# EAGLE design openSIM_interconenctBoard (EAGLE 9.5.2)
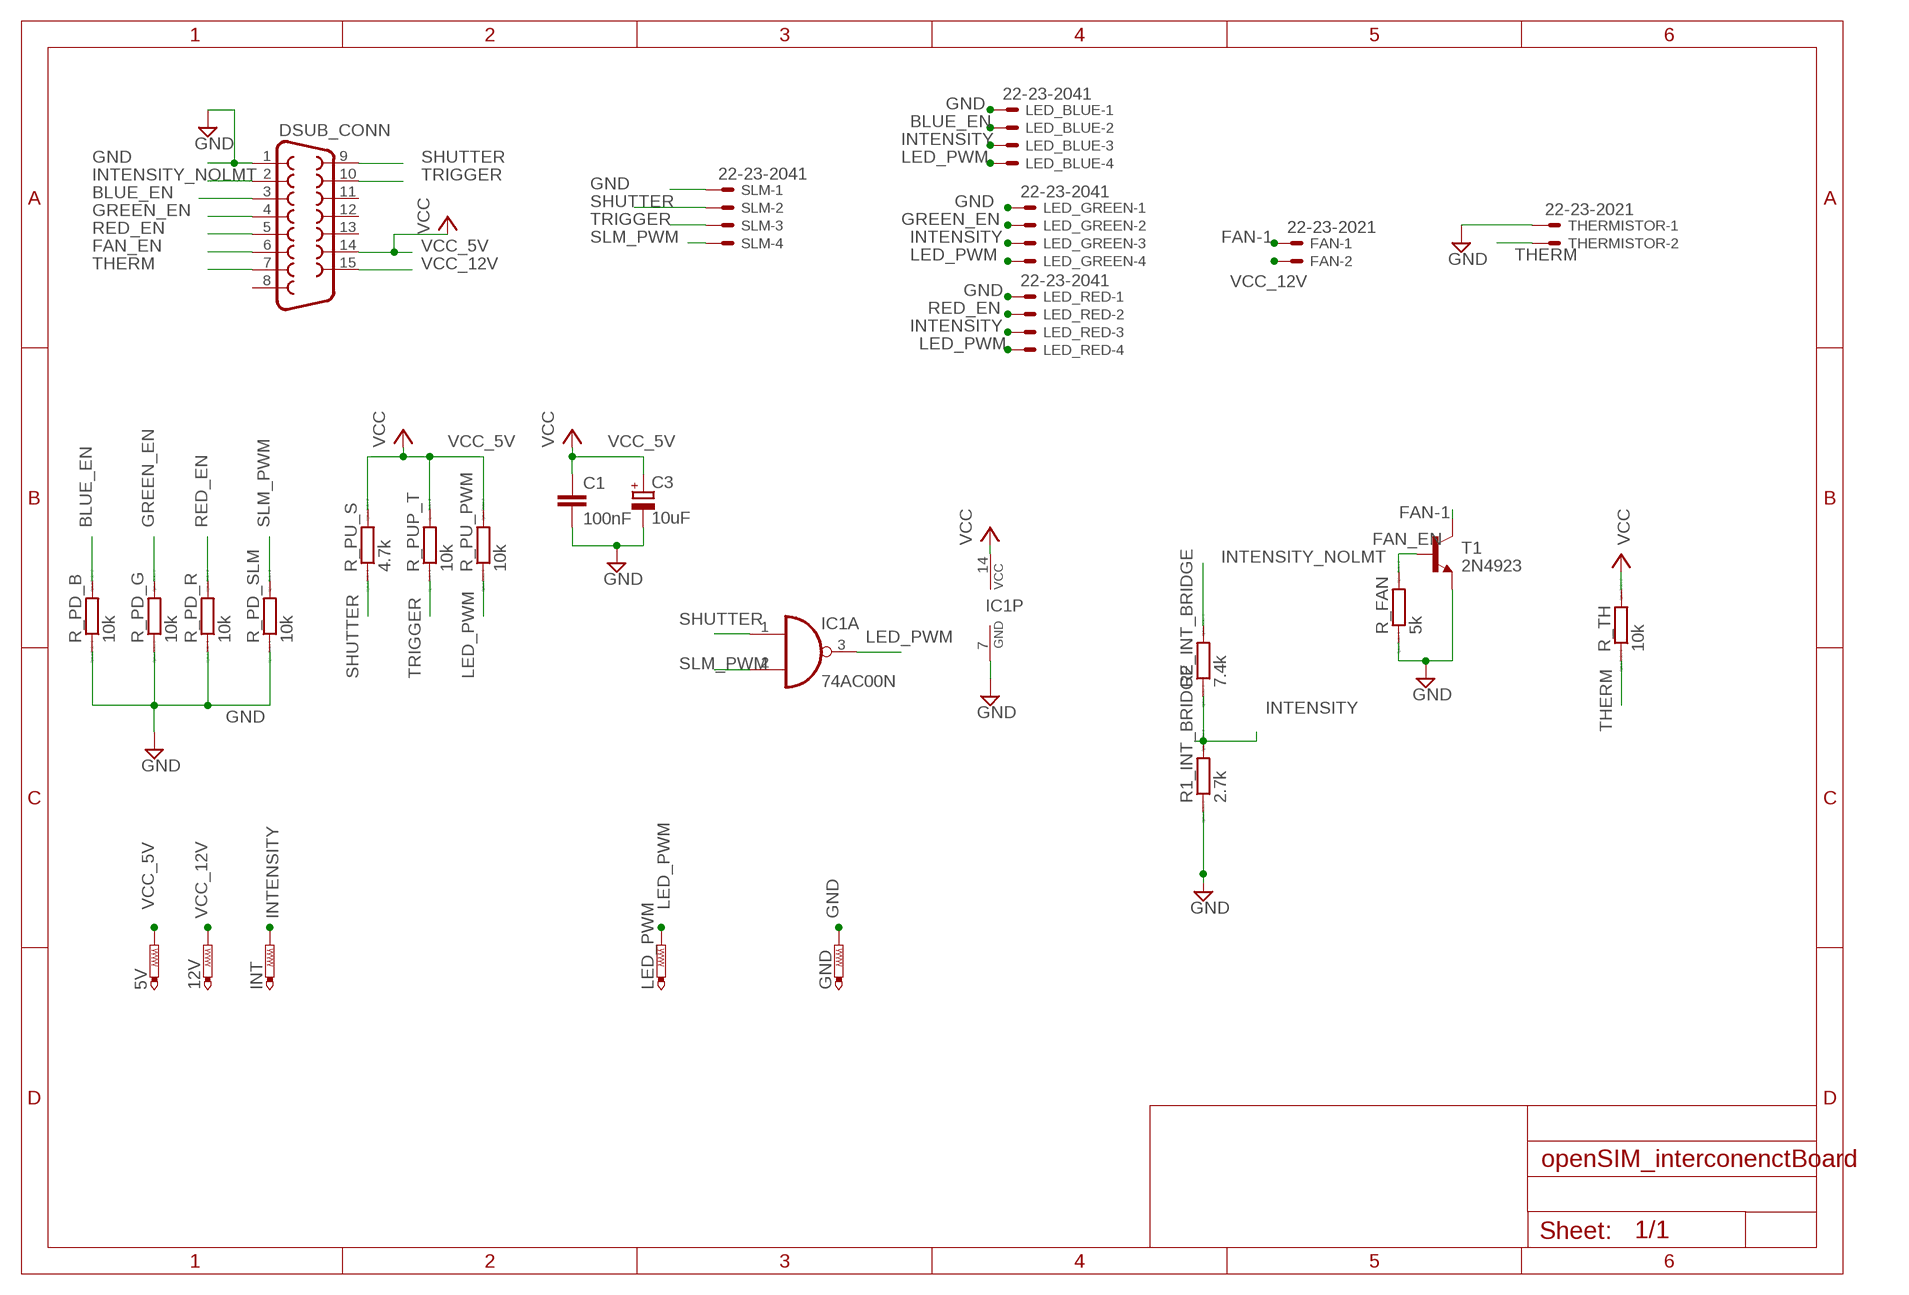
[diagram p0: schematic, sheet 1]

## Parts
5V  PTR1PAD1-20  [P1-20]
12V  PTR1PAD1-20  [P1-20]
C1  100nF  C-EU050-025X075  [C050-025X075]
C3  10uF  CPOL-EUE2,5-6E  [E2,5-6E]
DSUB_CONN  F15V  [F15V]
FAN  22-23-2021  [22-23-2021]
GND  PTR1PAD1-13Y  [P1-13Y]
IC1  74AC00N  [DIL14]
INT  PTR1PAD1-20  [P1-20]
LED_BLUE  22-23-2041  [22-23-2041]
LED_GREEN  22-23-2041  [22-23-2041]
LED_PWM  PTR1PAD1-20  [P1-20]
LED_RED  22-23-2041  [22-23-2041]
R1_INT_BRIDGE  2.7k  R0207/10  [0207/10]
R2_INT_BRIDGE  7.4k  R0207/10  [0207/10]
R_FAN  5k  R0207/10  [0207/10]
R_PD_B  10k  R0207/10  [0207/10]
R_PD_G  10k  R0207/10  [0207/10]
R_PD_R  10k  R0207/10  [0207/10]
R_PD_SLM  10k  R0207/10  [0207/10]
R_PU_PWM  10k  R0207/10  [0207/10]
R_PU_S  4.7k  R0207/10  [0207/10]
R_PUP_T  10k  R0207/10  [0207/10]
R_TH  10k  R0207/10  [0207/10]
SLM  22-23-2041  [22-23-2041]
T1  2N4923  [TO126]
THERMISTOR  22-23-2021  [22-23-2021]

## Nets
BLUE_EN: DSUB_CONN.3 LED_BLUE.2 R_PD_B.2
FAN-1: FAN.1 T1.2(C)
FAN_EN: DSUB_CONN.6 R_FAN.2 T1.3(B)
GND: C1.2 C3.- DSUB_CONN.1 GND.TP IC1.7(P:GND) LED_BLUE.1 LED_GREEN.1 LED_RED.1 R1_INT_BRIDGE.1 R_FAN.1 R_PD_B.1 R_PD_G.1 R_PD_R.1 R_PD_SLM.1 SLM.1 T1.1(E) THERMISTOR.1
GREEN_EN: DSUB_CONN.4 LED_GREEN.2 R_PD_G.2
INTENSITY: INT.TP LED_BLUE.3 LED_GREEN.3 LED_RED.3 R1_INT_BRIDGE.2 R2_INT_BRIDGE.1
INTENSITY_NOLMT: DSUB_CONN.2 R2_INT_BRIDGE.2
LED_PWM: IC1.3(A:O) LED_BLUE.4 LED_GREEN.4 LED_PWM.TP LED_RED.4 R_PU_PWM.1
RED_EN: DSUB_CONN.5 LED_RED.2 R_PD_R.2
SHUTTER: DSUB_CONN.9 IC1.1(A:I0) R_PU_S.1 SLM.2
SLM_PWM: IC1.2(A:I1) R_PD_SLM.2 SLM.4
THERM: DSUB_CONN.7 R_TH.1 THERMISTOR.2
TRIGGER: DSUB_CONN.10 R_PUP_T.1 SLM.3
VCC_5V: 5V.TP C1.1 C3.+ DSUB_CONN.14 IC1.14(P:VCC) R_PU_PWM.2 R_PU_S.2 R_PUP_T.2 R_TH.2 ; supply symbol labelled VCC
VCC_12V: 12V.TP DSUB_CONN.15 FAN.2
Unconnected: DSUB_CONN.8 DSUB_CONN.11 DSUB_CONN.12 DSUB_CONN.13 IC1.4(B:I0) IC1.5(B:I1) IC1.6(B:O) IC1.8(C:O) IC1.9(C:I0) IC1.10(C:I1) IC1.11(D:O) IC1.12(D:I0) IC1.13(D:I1)

## Library data of the parts
5V 12V GND INT LED_PWM = testpad:PTR1: TEST PIN
C1 = rcl:C-EU: CAPACITOR, European symbol; SPICEPREFIX: C
C3 = rcl:CPOL-EU: POLARIZED CAPACITOR, European symbol; SPICEPREFIX: C
DSUB_CONN = con-subd:F15: SUB-D; OC_FARNELL: unknown; OC_NEWARK: unknown
FAN THERMISTOR = con-molex:22-23-2021: .100" (2.54mm) Center Header - 2 Pin; MF: MOLEX; MPN: 22-23-2021; OC_FARNELL: 1462926; OC_NEWARK: 25C3832
IC1 = 74xx-eu:74*00: Quad 2-input NAND gate
LED_BLUE LED_GREEN LED_RED SLM = con-molex:22-23-2041: .100" (2.54mm) Center Header - 4 Pin; MF: MOLEX; MPN: 22-23-2041; OC_FARNELL: 1462920; OC_NEWARK: 38C0355
R1_INT_BRIDGE R2_INT_BRIDGE R_FAN R_PD_B R_PD_G R_PD_R R_PD_SLM R_PU_PWM R_PU_S R_PUP_T R_TH = eagle-ltspice:R: RESISTOR, European symbol; SPICEMODEL: NONE; SPICEPREFIX: R
T1 = transistor:2N4923: NPN TRANSISTOR

## Board
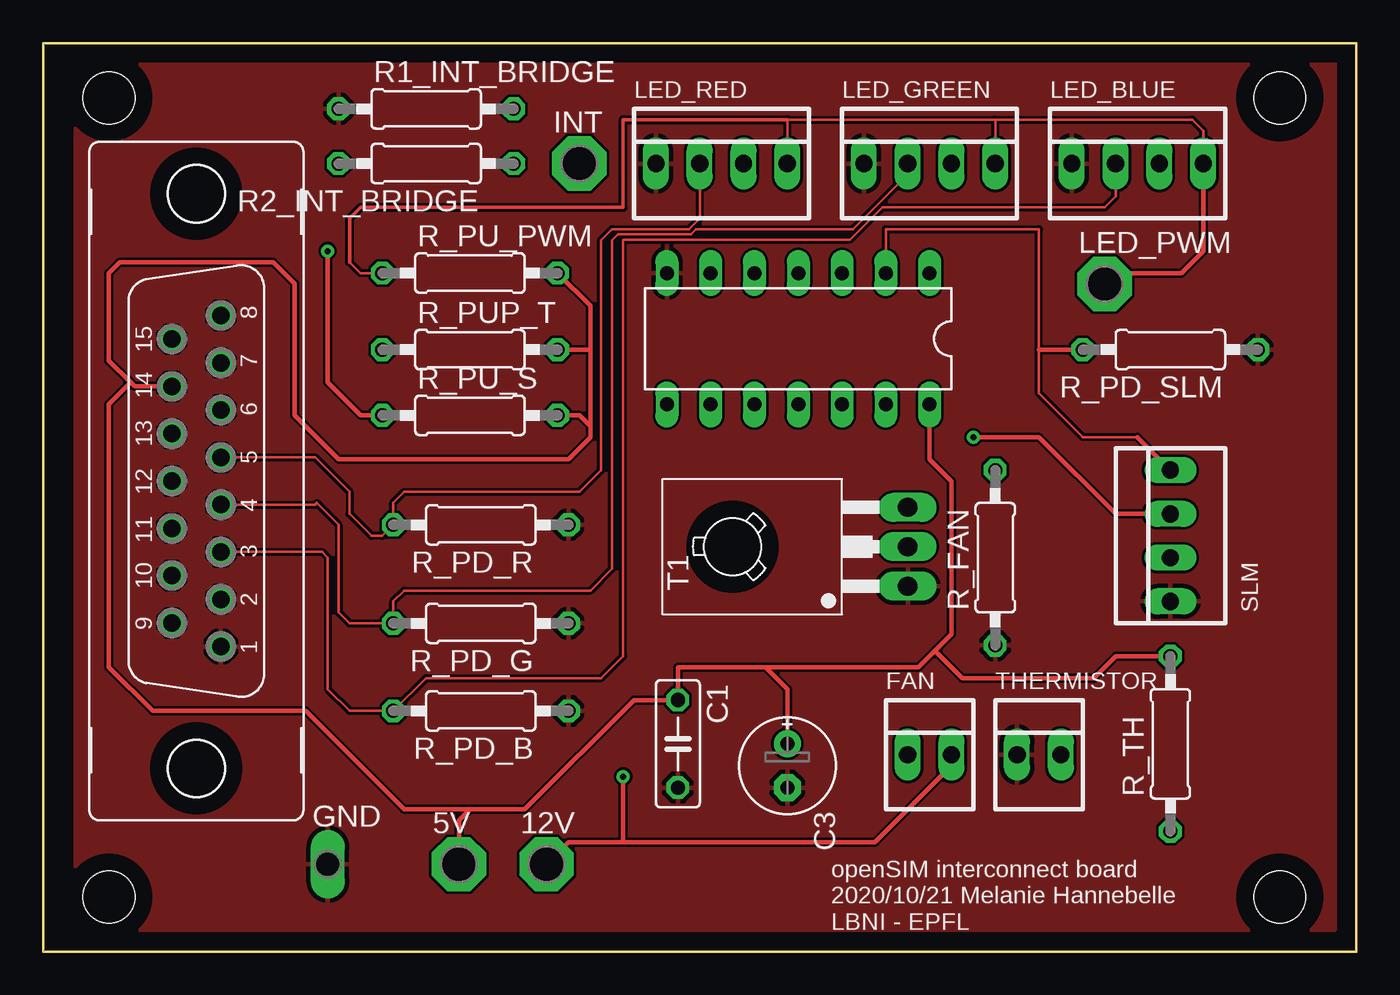
[diagram p1: board, top side]
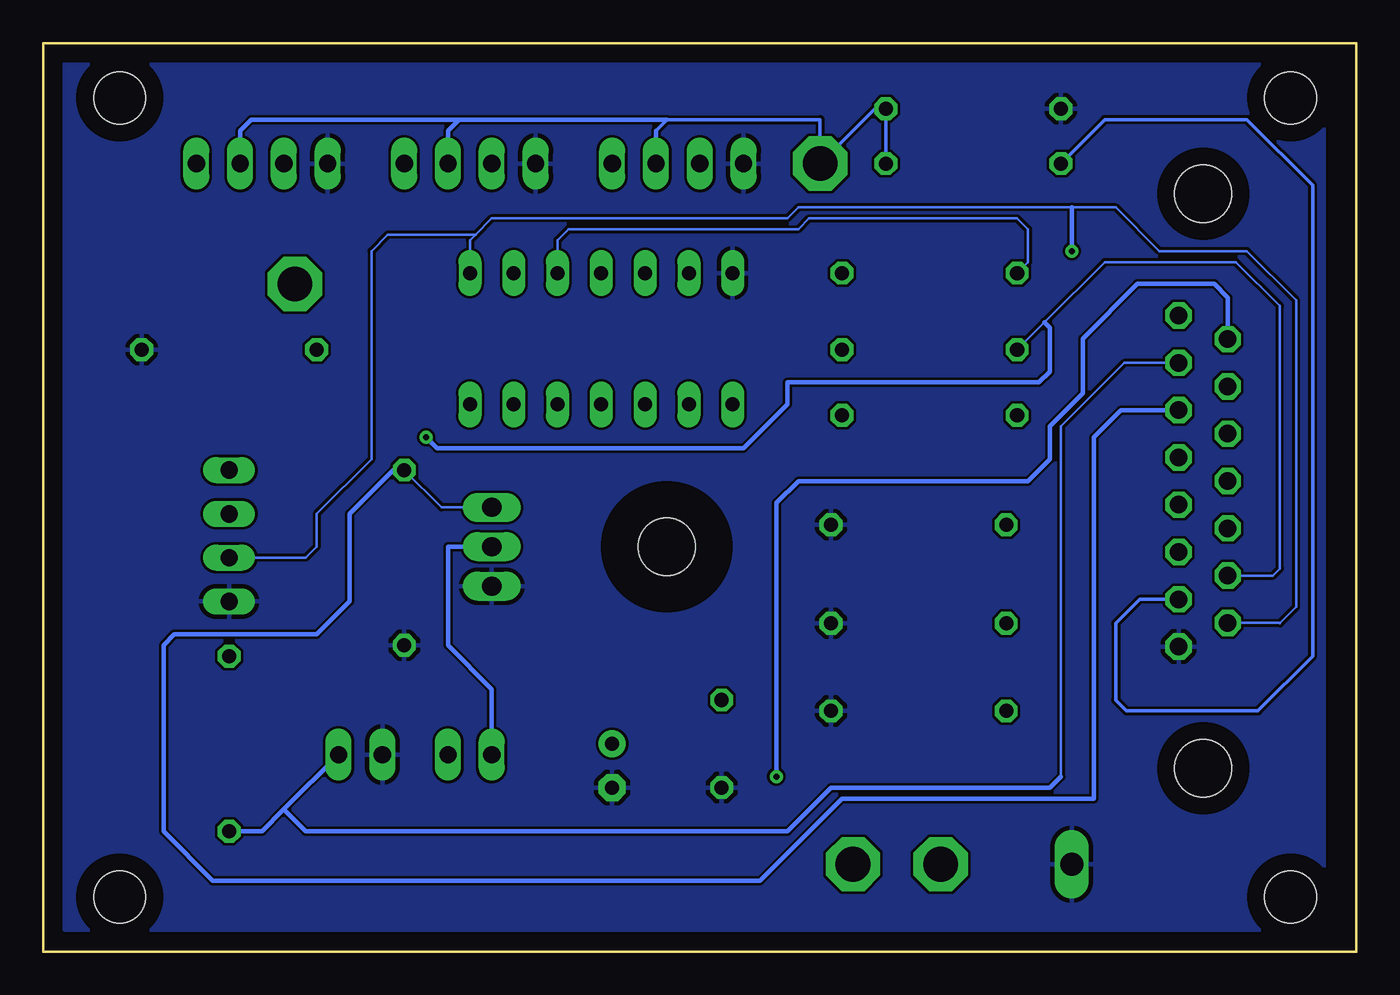
[diagram p2: board, bottom side, seen from below]

Size 76.2 x 52.7 mm. Coordinates in mm from the lower left corner, seen from the top.
Outline: 0,52.7 76.2,52.7 76.2,0 0,0 0,52.7
Copper layers (1*16): Top 0.035mm / dielectric 1.5mm / Bottom 0.035mm
Design rules "default": minimum track width 6mil, minimum drill 0.35mm, track to track 6mil, track to pad 6mil, pad to pad 6mil, via to via 6mil, smd to smd 6mil, copper to edge 40mil, drill to drill 6mil, minimum pad ring 10mil, minimum via ring 8mil, stop-mask expansion 4mil, vias tented up to drill 0mil, thermal gap 10mil
Holes 3 mm at 3.81,49.53 71.75,49.53 71.75,3.17 3.81,3.17

### Footprints (pad centres in the part's own frame; a part is rotated, then mirrored left to right if it is on the bottom)
P1-20 = drill 2.007 pad 3.15 octagon: TP 0,0
C050-025X075 = drill 0.813 octagon: 1 -2.54,0; 2 2.54,0
E2,5-6E = drill 0.813 pad 1.575: + -1.27,0 | drill 0.813 pad 1.575 octagon: - 1.27,0
F15V = drill 1.016 octagon: 1 9.601,1.422; 2 6.858,1.422; 3 4.115,1.422; 4 1.372,1.422; 5 -1.372,1.422; 6 -4.115,1.422; 7 -6.858,1.422; 8 -9.601,1.422; 9 8.23,-1.422; 10 5.486,-1.422; 11 2.743,-1.422; 12 0,-1.422; 13 -2.743,-1.422; 14 -5.486,-1.422; 15 -8.23,-1.422 | hole 3.302: 16.662,0; -16.662,0
22-23-2021 = drill 1 long: 1 -1.27,0; 2 1.27,0
P1-13Y = drill 1.321 pad 1.905 long: TP 0,0
DIL14 = drill 0.813 long: 1 -7.62,-3.81; 2 -5.08,-3.81; 3 -2.54,-3.81; 4 0,-3.81; 5 2.54,-3.81; 6 5.08,-3.81; 7 7.62,-3.81; 8 7.62,3.81; 9 5.08,3.81; 10 2.54,3.81; 11 0,3.81; 12 -2.54,3.81; 13 -5.08,3.81; 14 -7.62,3.81
22-23-2041 = drill 1 long: 1 -3.81,0; 2 -1.27,0; 3 1.27,0; 4 3.81,0
0207/10 = drill 0.813 octagon: 1 -5.08,0; 2 5.08,0
TO126 = drill 1.118 long: 1 -2.286,-5.08; 2 0,-5.08; 3 2.286,-5.08 | hole 3.302: 0,5.08

### Placement (x,y rotation side)
5V  24.13,5.08 0 top
12V  29.21,5.08 0 top
C1  36.83,12.06 270 top
C3  43.18,10.8 270 top
DSUB_CONN  8.89,27.3 270 top
FAN  51.44,11.43 0 top
GND  16.51,5.08 0 top
IC1  43.81,35.56 180 top
INT  31.11,45.72 0 top
LED_BLUE  63.5,45.72 0 top
LED_GREEN  51.44,45.72 0 top
LED_PWM  61.59,38.73 0 top
LED_RED  39.37,45.72 0 top
R1_INT_BRIDGE  22.23,48.89 0 top
R2_INT_BRIDGE  22.23,45.72 180 top
R_FAN  55.24,22.86 90 top
R_PD_B  25.4,13.97 180 top
R_PD_G  25.4,19.05 180 top
R_PD_R  25.4,24.76 180 top
R_PD_SLM  65.41,34.92 180 top
R_PU_PWM  24.77,39.37 0 top
R_PU_S  24.77,31.11 0 top
R_PUP_T  24.77,34.92 0 top
R_TH  65.41,12.06 90 top
SLM  65.41,24.13 90 top
T1  45.09,23.49 90 top
THERMISTOR  57.78,11.43 0 top

### Tracks (layer width: path | path; a pad name or v marks a point on that pad's centre or on a via)
BLUE_EN
  Top 0.152: DSUB_CONN.3 16.18,23.19 16.51,22.86 16.51,15.24 17.78,13.97 R_PD_B.2 22.23,15.88 32.38,15.88 33.66,17.14 33.66,41.27 33.68,41.3 46.81,41.3 48.69,43.18 61.59,43.18 62.23,43.81 LED_BLUE.2
FAN-1
  Bottom 0.254: FAN.1 50.16,15.24 52.7,17.78 52.7,23.49 T1.2
FAN_EN
  Bottom 0.152: R_FAN.2 53.09,25.78 T1.3
  Bottom 0.254: DSUB_CONN.6 13.66,31.42 15.24,29.84 15.24,8.89 29.84,8.89 34.61,4.13 66.36,4.13 69.22,6.98 69.22,17.78 68.58,18.41 60.33,18.41 58.42,20.32 58.42,25.4 55.88,27.94 R_FAN.2
GND
  pour Top: 1.91,52.07 74.93,52.07 74.93,1.27 1.91,1.27
  pour Bottom: 1.91,52.07 74.93,52.07 74.93,1.27 1.91,1.27
GREEN_EN
  Top 0.152: DSUB_CONN.4 15.77,25.93 15.88,26.03 17.14,24.76 17.14,19.68 17.78,19.05 R_PD_G.2 20.32,20.32 20.95,20.95 31.75,20.95 33.02,22.22 33.02,41.27 33.35,41.6 37.59,41.6 37.9,41.91 46.99,41.91 50.16,45.09 LED_GREEN.2
INTENSITY
  Bottom 0.203: 40.64,47.62 40.01,48.26 31.11,48.26 INT.TP 27.94,48.89 R1_INT_BRIDGE.2 R2_INT_BRIDGE.1
  Bottom 0.254: LED_BLUE.3 64.77,47.62 64.14,48.26 52.07,48.26 | 52.07,48.26 40.01,48.26 | LED_GREEN.3 52.7,47.62 52.07,48.26 | LED_RED.3 40.64,47.62
INTENSITY_NOLMT
  Bottom 0.203: DSUB_CONN.2 12.57,20.45 13.97,19.05 13.97,14.6 13.34,13.97 5.71,13.97 2.54,17.14 2.54,44.45 6.35,48.26 14.61,48.26 R2_INT_BRIDGE.2
LED_PWM
  Top 0.152: R_PU_PWM.1 18.41,39.37 17.78,40 | 55.24,48.26 43.18,48.26 LED_RED.4 | 55.24,48.26 66.67,48.26 67.31,47.62 LED_BLUE.4 | LED_GREEN.4 55.24,48.26
  Top 0.203: 17.78,40 17.78,42.55 18.41,43.18 33.66,43.18 33.66,48.26 43.18,48.26
  Top 0.254: LED_PWM.TP 62.23,39.37 66.04,39.37 67.31,40.64 LED_BLUE.4
  Bottom 0.152: IC1.3 46.35,41.27 45.72,41.91 32.38,41.91 31.75,42.55 19.68,42.55 19.05,41.91 19.05,40 R_PU_PWM.1
RED_EN
  Top 0.152: DSUB_CONN.5 15.77,28.68 17.78,26.67 17.78,25.4 19.05,24.13 19.68,24.13 R_PD_R.2 20.32,26.03 20.95,26.67 31.11,26.67 32.38,27.94 32.38,41.27 33.02,41.91 37.47,41.91 38.1,42.55 LED_RED.2
SHUTTER  (via drill 0.35)
  Top 0.254: R_PU_S.1 18.41,31.11 16.51,33.02 v16.51,40.64
  Bottom 0.152: DSUB_CONN.9 4.47,19.07 4.45,19.05 3.49,20 3.49,37.78 6.35,40.64 11.43,40.64 13.97,43.18 16.51,43.18 32.38,43.18 33.02,42.55 50.16,42.55 51.12,41.59 | 51.12,41.59 51.44,41.27 IC1.1 | 51.12,41.59 56.2,41.59 57.15,40.64 57.15,28.57 60.33,25.4 60.33,23.49 60.96,22.86 SLM.2
  Bottom 0.254: v16.51,40.64 16.51,43.18
SLM_PWM
  Top 0.152: 63.5,29.84 60.33,29.84 57.78,32.38 57.78,34.92 57.78,41.91 48.9,41.91 IC1.2
  Top 0.254: SLM.4 63.5,29.84 | R_PD_SLM.2 57.78,34.92
THERM
  Bottom 0.152: DSUB_CONN.7 13.46,34.16 17.14,30.48 17.14,10.16
  Bottom 0.254: R_TH.1 63.5,6.98 62.23,8.25 | 62.23,8.25 THERMISTOR.2 | 17.14,10.16 17.78,9.52 30.48,9.52 33.02,6.98 60.96,6.98 62.23,8.25
TRIGGER  (via drill 0.35)
  Top 0.254: SLM.3 62.23,25.4 57.78,29.84 v53.98,29.84
  Bottom 0.152: DSUB_CONN.10 4.85,21.82 4.45,22.22 4.45,37.46 6.99,40 14.61,40 18.1,36.51 R_PUP_T.1
  Bottom 0.254: v53.98,29.84 53.34,29.21 35.56,29.21 33.02,31.75 33.02,33.02 18.41,33.02 17.78,33.66 17.78,36.19 18.1,36.51
VCC_5V
  Top 0.254: DSUB_CONN.14 5.31,32.79 5.08,33.02 | 5.08,33.02 3.81,34.29 3.81,39.37 4.45,40 13.34,40 14.61,38.73 14.61,31.11 17.14,28.57 30.48,28.57 31.75,29.84 31.75,30.48 | 41.91,16.51 36.83,16.51 C1.1 34.29,14.6 27.94,8.25 24.77,8.25 | C3.+ 43.18,15.24 41.91,16.51 | 51.75,17.46 50.8,16.51 41.91,16.51 | 51.75,17.46 52.7,18.41 52.7,27.3 51.44,28.57 IC1.14 | 51.75,17.46 53.34,15.88 60.96,15.88 62.23,17.14 R_TH.2 | 5.08,33.02 3.81,31.75 3.81,16.51 6.35,13.97 15.24,13.97 20.95,8.25 24.77,8.25 | 5V.TP 24.13,7.62 24.77,8.25 | 31.75,30.48 31.75,34.92 | 31.75,34.92 31.75,37.46 R_PU_PWM.2 | R_PUP_T.2 31.75,34.92 | R_PU_S.2 31.11,31.11 31.75,30.48
VCC_12V  (via drill 0.35)
  Top 0.254: 12V.TP 30.48,6.35 33.66,6.35 | 33.66,6.35 48.26,6.35 52.7,10.8 FAN.2 | v33.66,10.16 33.66,6.35
  Bottom 0.254: DSUB_CONN.15 7.47,37.95 8.26,38.73 12.7,38.73 15.88,35.56 15.88,32.38 17.78,30.48 17.78,28.57 19.05,27.3 32.38,27.3 33.66,26.03 v33.66,10.16

### Text on the board
tNames: openSIM interconnect board / 2020/10/21 Melanie Hannebelle / LBNI - EPFL